# EAGLE design MinSys (EAGLE 7.2.0)
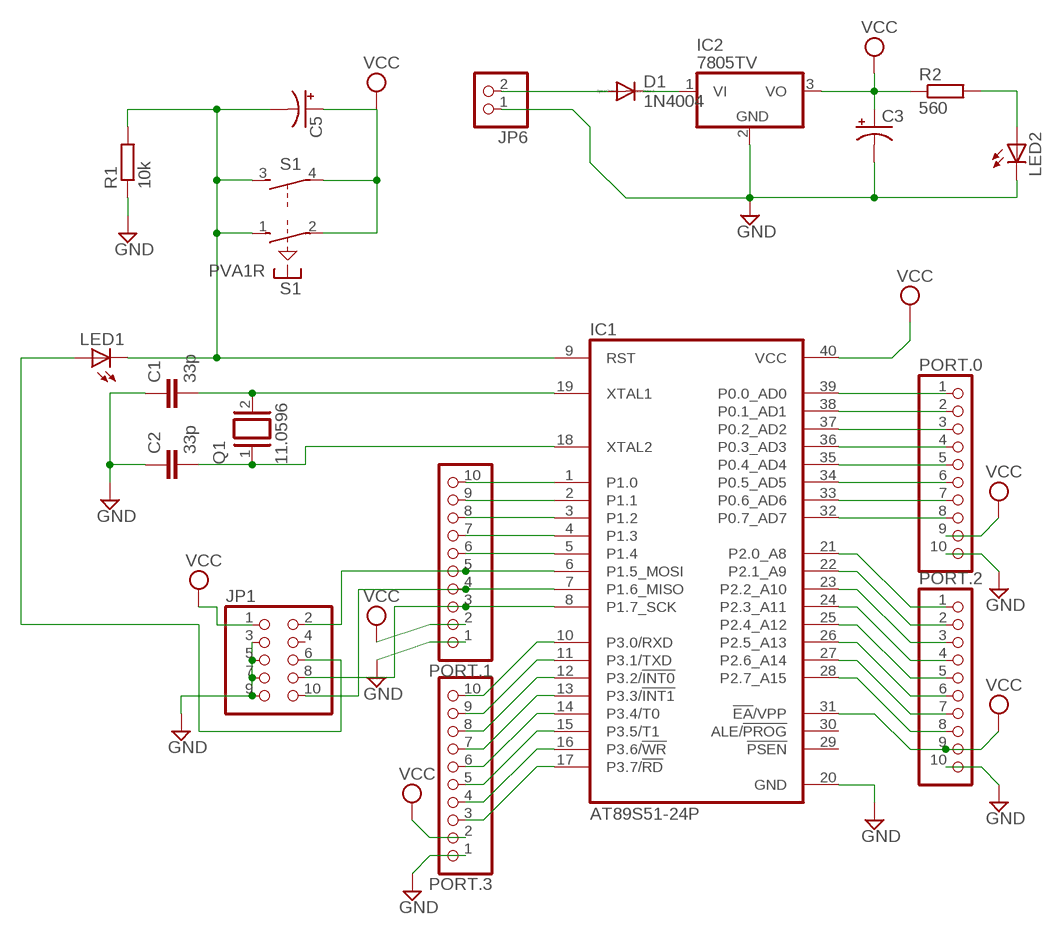
[diagram p0: schematic, sheet 1]

## Parts
C1  33p  C2,5-3  [C2.5-3]
C2  33p  C2,5-3  [C2.5-3]
C3  CPOL-USE3.5-8  [E3,5-8]
C5  CPOL-USE2.5-6  [E2,5-6]
D1  1N4004  [DO41-10]
IC1  AT89S51-24P  [DIL40]
IC2  7805TV  [TO220V]
JP1  PINHD-2X5  [2X05]
JP6  PINHD-1X2  [1X02]
LED1  LED3MM  [LED3MM]
LED2  LED3MM  [LED3MM]
PORT.0  PINHD-1X10  [1X10]
PORT.1  PINHD-1X10  [1X10]
PORT.2  PINHD-1X10  [1X10]
PORT.3  PINHD-1X10  [1X10]
Q1  11.0596  XTAL/S  [QS]
R1  10k  R-EU_0207/10  [0207/10]
R2  560  R-EU_0207/10  [0207/10]
S1  PVA1R  [PVA1R]

## Nets
GND: C1.1 C2.1 C3.- IC1.20(GND) IC2.2(GND) JP1.3 JP1.5 JP1.7 JP1.9 JP6.1 LED2.K(C) PORT.0.10 PORT.1.1 PORT.2.10 PORT.3.1 R1.1
N$1: IC1.10(P3.0/RXD) PORT.3.10
N$2: IC1.11(P3.1/TXD) PORT.3.9
N$3: IC1.12(P3.2/!INT0) PORT.3.8
N$4: IC1.13(P3.3/!INT1) PORT.3.7
N$5: IC1.14(P3.4/T0) PORT.3.6
N$6: IC1.15(P3.5/T1) PORT.3.5
N$7: IC1.16(P3.6/!WR) PORT.3.4
N$8: IC1.17(P3.7/!RD) PORT.3.3
N$9: C1.2 IC1.19(XTAL1) Q1.2
N$10: C2.2 IC1.18(XTAL2) Q1.1
N$11: IC1.21(P2.0_A8) PORT.2.1
N$12: IC1.22(P2.1_A9) PORT.2.2
N$13: IC1.23(P2.2_A10) PORT.2.3
N$14: IC1.24(P2.3_A11) PORT.2.4
N$15: IC1.25(P2.4_A12) PORT.2.5
N$16: IC1.26(P2.5_A13) PORT.2.6
N$17: IC1.27(P2.6_A14) PORT.2.7
N$18: IC1.28(P2.7_A15) PORT.2.8
N$19: IC1.1(P1.0) PORT.1.10
N$20: IC1.2(P1.1) PORT.1.9
N$21: IC1.3(P1.2) PORT.1.8
N$22: IC1.4(P1.3) PORT.1.7
N$23: IC1.5(P1.4) PORT.1.6
N$24: D1.A JP6.2
N$25: IC1.7(P1.6_MISO) JP1.10 PORT.1.4
N$26: IC1.8(P1.7_SCK) JP1.8 PORT.1.3
N$27: IC1.39(P0.0_AD0) PORT.0.1
N$28: IC1.38(P0.1_AD1) PORT.0.2
N$29: IC1.37(P0.2_AD2) PORT.0.3
N$30: IC1.36(P0.3_AD3) PORT.0.4
N$31: IC1.35(P0.4_AD4) PORT.0.5
N$32: IC1.34(P0.5_AD5) PORT.0.6
N$33: IC1.33(P0.6_AD6) PORT.0.7
N$34: IC1.32(P0.7_AD7) PORT.0.8
N$35: JP1.6 LED1.A
N$36: D1.C IC2.1(VI)
N$38: C5.- IC1.9(RST) LED1.K(C) R1.2 S1.1(1:S) S1.3(2:S)
N$39: IC1.6(P1.5_MOSI) JP1.2 PORT.1.5
N$41: LED2.A R2.2
VCC: C3.+ C5.+ IC1.31(!EA!/VPP) IC1.40(VCC) IC2.3(VO) JP1.1 PORT.0.9 PORT.1.2 PORT.2.9 PORT.3.2 R2.1 S1.2(1:P) S1.4(2:P)
Unconnected: IC1.29(!PSEN) IC1.30(ALE/!PROG) JP1.4

## Library data of the parts
C1 C2 = capacitor-wima:C: CAPACITOR naming: grid - package width
C3 C5 = rcl:CPOL-US: POLARIZED CAPACITOR, American symbol
D1 = diode:1N4004: DIODE general purpose rectifier, 1 A
IC1 = atmel:AT89S51-*: 8-bit Microcontroller with 4K BytesIn-System Programmable Flash Source: http://www.atmel.com/dyn/resources/prod_documents/doc2487.pdf; MPN: AT89S51-24PU; OC_FARNELL: 1095739; OC_NEWARK: 96K6578
IC2 = linear:78*: Positive VOLTAGE REGULATOR Source: http://cache.national.com/ds/LM/LM78L05.pdf http://www.fairchildsemi.com/ds/LM/LM7805.pdf
JP1 = pinhead:PINHD-2X5: PIN HEADER
JP6 = pinhead:PINHD-1X2: PIN HEADER
LED1 LED2 = led:LED: LED OSRAM: - CHIPLED LG R971, LG N971, LY N971, LG Q971, LY Q971, LO R971, LY R971 LH N974, LH R974 LS Q976, LO Q976, LY Q976 LO Q996 - Hyper CHIPLED LW Q18S LB Q993, LB Q99A, LB R99A - SideLED LS A670, LO A670, LY A670, LG A670, LP A670 LB A673, LV A673, LT A673, LW A673 LH A674 LY A675 LS A676, LA A676, LO A676, LY A676, LW A676 LS A679, LY A679, LG A679 - Hyper Micro SIDELED® LS Y876, LA Y876, LO Y876, LY Y876 LT Y87S - SmartLED LW L88C, LW L88S LB L89C, LB L89S, LG L890 LS L89K, LO L89K, LY L89K LS L896, LA L896, LO L896, LY L896 - TOPLED LS T670, LO T670, LY T670, LG T670, LP T670 LSG T670, LSP T670, LSY T670, LOP T670, LYG T670 LG T671, LOG T671, LSG T671 LB T673, LV T673, LT T673, LW T673 LH T674 LS T676, LA T676, LO T676, LY T676, LB T676, LH T676, LSB T676, LW T676 LB T67C, LV T67C, LT T67C, LS T67K, LO T67K, LY T67K, LW E67C LS E67B, LA E67B, LO E67B, LY E67B, LB E67C, LV E67C, LT E67C LW T67C LS T679, LY T679, LG T679 LS T770, LO T770, LY T770, LG T770, LP T770 LB T773, LV T773, LT T773, LW T773 LH T774 LS E675, LA E675, LY E675, LS T675 LS T776, LA T776, LO T776, LY T776, LB T776 LHGB T686 LT T68C, LB T68C - Hyper Mini TOPLED® LB M676 - Mini TOPLED Santana® LG M470 LS M47K, LO M47K, LY M47K Source: http://www.osram.convergy.de LUXEON: - LUMILED® LXK2-PW12-R00, LXK2-PW12-S00, LXK2-PW14-U00, LXK2-PW14-V00 LXK2-PM12-R00, LXK2-PM12-S00, LXK2-PM14-U00 LXK2-PE12-Q00, LXK2-PE12-R00, LXK2-PE12-S00, LXK2-PE14-T00, LXK2-PE14-U00 LXK2-PB12-K00, LXK2-PB12-L00, LXK2-PB12-M00, LXK2-PB14-N00, LXK2-PB14-P00, LXK2-PB14-Q00 LXK2-PR12-L00, LXK2-PR12-M00, LXK2-PR14-Q00, LXK2-PR14-R00 LXK2-PD12-Q00, LXK2-PD12-R00, LXK2-PD12-S00 LXK2-PH12-R00, LXK2-PH12-S00 LXK2-PL12-P00, LXK2-PL12-Q00, LXK2-PL12-R00 Source: www.luxeon.com KINGBRIGHT: KA-3528ASYC Source: www.kingbright.com
PORT.0 PORT.1-PORT.3 = pinhead:PINHD-1X10: PIN HEADER
Q1 = special:XTAL/S: CRYSTAL
R1 = rcl:R-EU_: RESISTOR, European symbol
R2 = resistor:R-EU_: RESISTOR, European symbol
S1 = switch-misc:PVA1R: ITT SWITCH

## Board
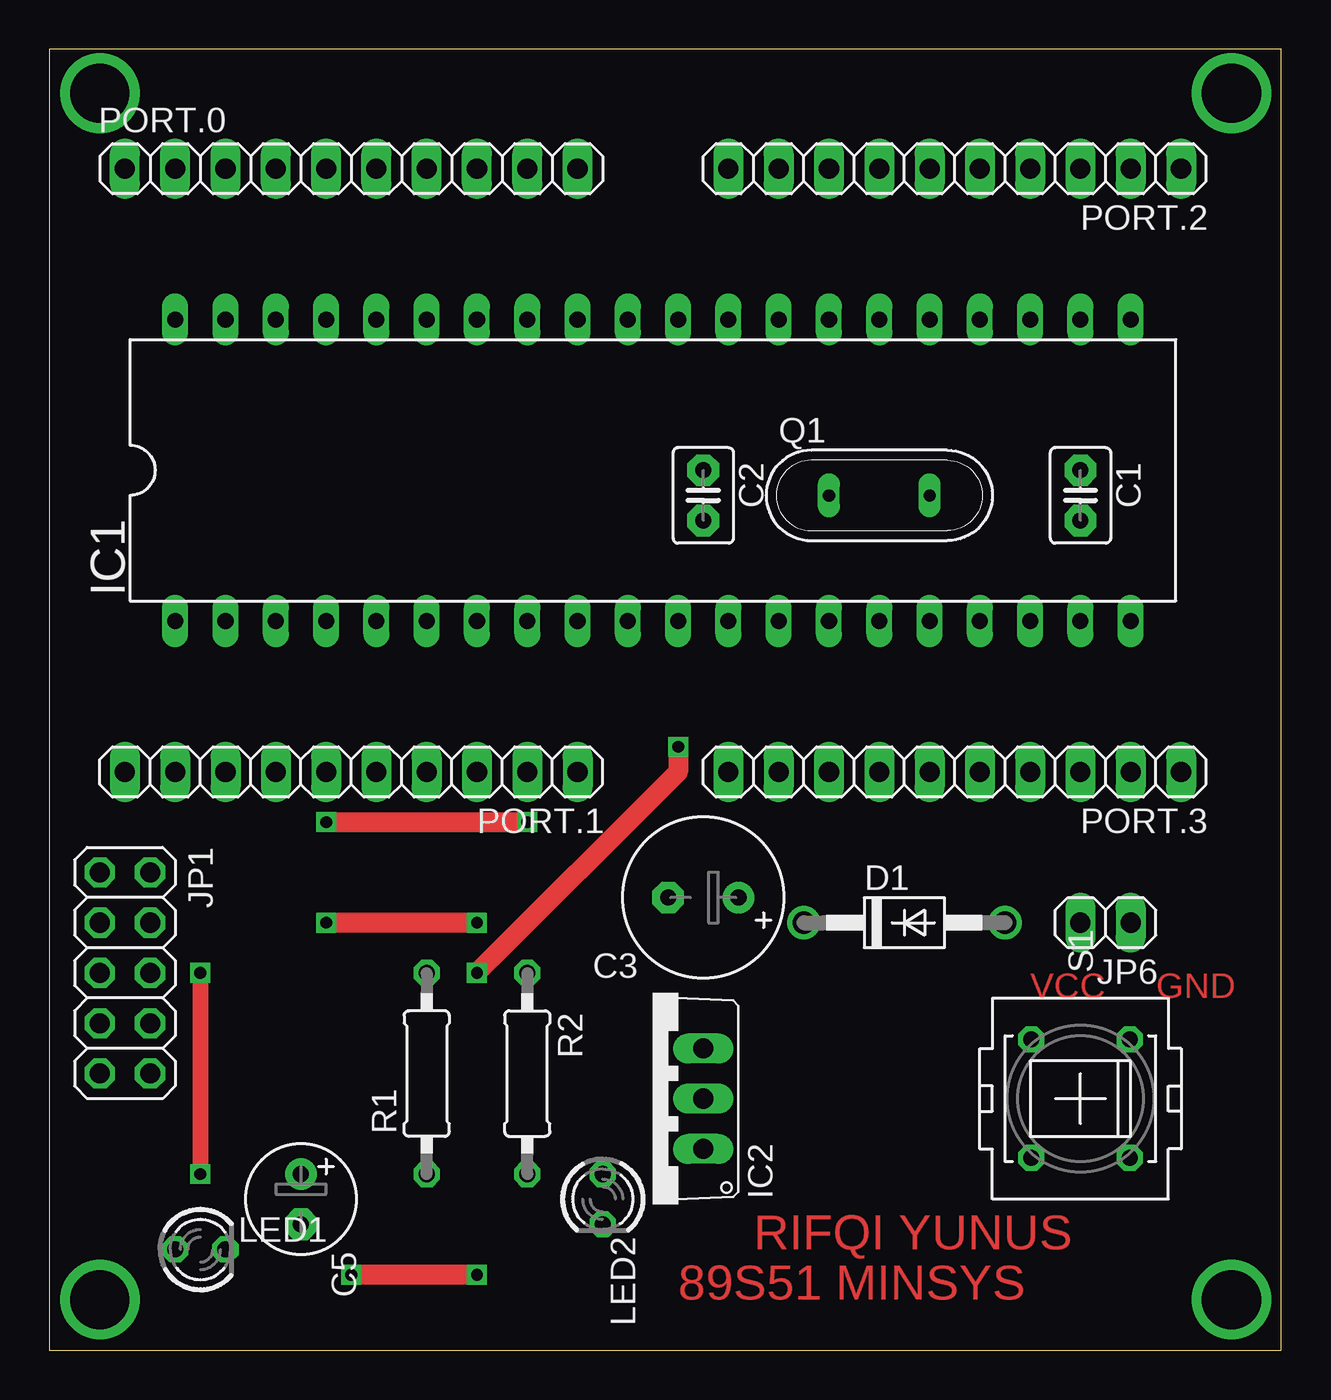
[diagram p1: board, top side]
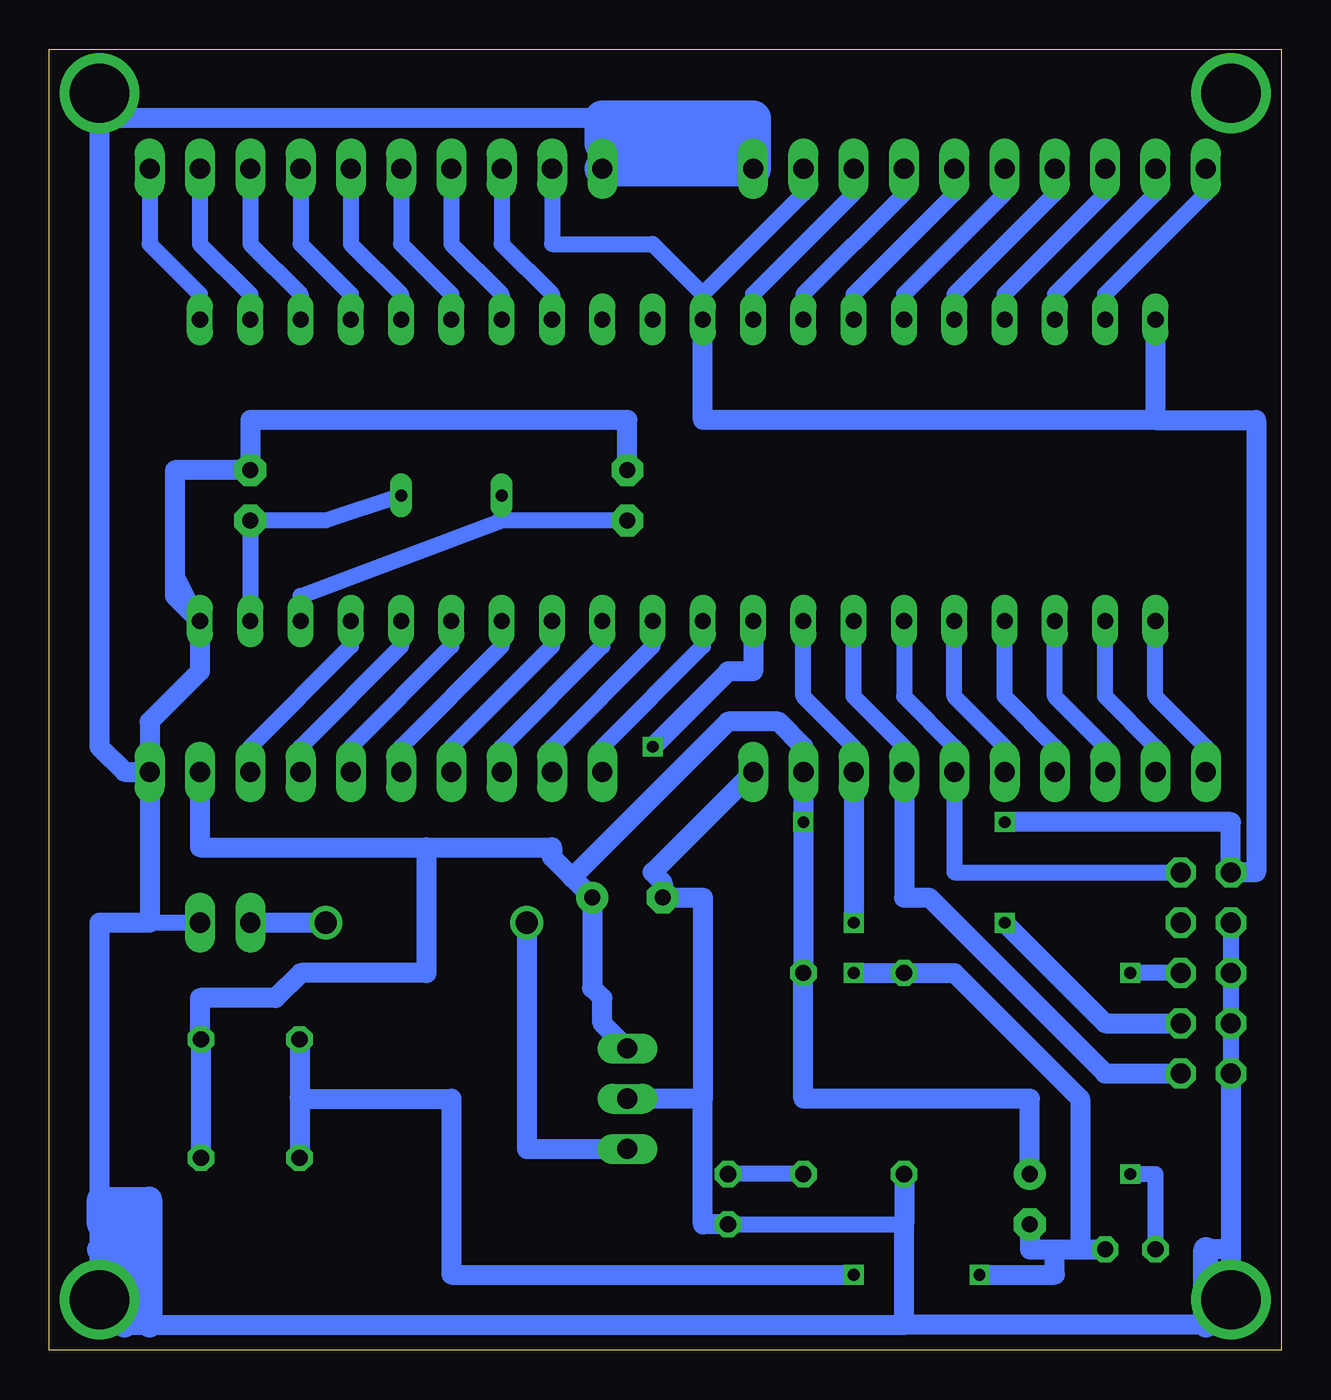
[diagram p2: board, bottom side, seen from below]

Size 62.21 x 65.71 mm. Coordinates in mm from the lower left corner, seen from the top.
Outline: 0,0 62.21,0 62.21,65.71 0,65.71 0,0
Copper layers (1*16): Top 0.035mm / dielectric 1.5mm / Bottom 0.035mm
Design rules "default": minimum track width 10mil, minimum drill 24mil, track to track 8mil, track to pad 8mil, pad to pad 8mil, via to via 8mil, smd to smd 8mil, copper to edge 40mil, drill to drill 8mil, minimum pad ring 10mil, minimum via ring 8mil, stop-mask expansion 4mil, vias tented up to drill 0mil, thermal gap 10mil

### Footprints (pad centres in the part's own frame; a part is rotated, then mirrored left to right if it is on the bottom)
C2.5-3 = drill 0.813 pad 1.6 octagon: 1 -1.27,0; 2 1.27,0
E3,5-8 = drill 0.813 pad 1.6: + -1.778,0 | drill 0.813 pad 1.6 octagon: - 1.778,0
E2,5-6 = drill 0.813 pad 1.6: + -1.27,0 | drill 0.813 pad 1.6 octagon: - 1.27,0
DO41-10 = drill 1.118: A 5.08,0; C -5.08,0
DIL40 = drill 0.813 long: 1 -24.13,-7.62; 2 -21.59,-7.62; 3 -19.05,-7.62; 4 -16.51,-7.62; 5 -13.97,-7.62; 6 -11.43,-7.62; 7 -8.89,-7.62; 8 -6.35,-7.62; 9 -3.81,-7.62; 10 -1.27,-7.62; 11 1.27,-7.62; 12 3.81,-7.62; 13 6.35,-7.62; 14 8.89,-7.62; 15 11.43,-7.62; 16 13.97,-7.62; 17 16.51,-7.62; 18 19.05,-7.62; 19 21.59,-7.62; 20 24.13,-7.62; 21 24.13,7.62; 22 21.59,7.62; 23 19.05,7.62; 24 16.51,7.62; 25 13.97,7.62; 26 11.43,7.62; 27 8.89,7.62; 28 6.35,7.62; 29 3.81,7.62; 30 1.27,7.62; 31 -1.27,7.62; 32 -3.81,7.62; 33 -6.35,7.62; 34 -8.89,7.62; 35 -11.43,7.62; 36 -13.97,7.62; 37 -16.51,7.62; 38 -19.05,7.62; 39 -21.59,7.62; 40 -24.13,7.62
TO220V = drill 1.016 long: 1 -2.54,-2.54; 2 0,-2.54; 3 2.54,-2.54
2X05 = drill 1.016 octagon: 1 -5.08,-1.27; 2 -5.08,1.27; 3 -2.54,-1.27; 4 -2.54,1.27; 5 0,-1.27; 6 0,1.27; 7 2.54,-1.27; 8 2.54,1.27; 9 5.08,-1.27; 10 5.08,1.27
1X02 = drill 1.016 long: 1 -1.27,0; 2 1.27,0
LED3MM = drill 0.813 octagon: A -1.27,0; K 1.27,0
1X10 = drill 1.016 long: 1 -11.43,0; 2 -8.89,0; 3 -6.35,0; 4 -3.81,0; 5 -1.27,0; 6 1.27,0; 7 3.81,0; 8 6.35,0; 9 8.89,0; 10 11.43,0
QS = drill 0.61 long: 1 -2.54,0; 2 2.54,0
0207/10 = drill 0.813 octagon: 1 -5.08,0; 2 5.08,0
PVA1R = drill 0.813 octagon: 1 -2.997,2.489; 2 -2.997,-2.489; 3 2.997,2.489; 4 2.997,-2.489

### Placement (x,y rotation side)
C1  52.07,43.18 270 top
C2  33.02,43.18 270 top
C3  33.02,22.86 180 top
C5  12.7,7.62 270 top
D1  43.18,21.59 0 top
IC1  30.48,44.45 0 top
IC2  30.48,12.7 90 top
JP1  3.81,19.05 270 top
JP6  53.34,21.59 180 top
LED1  7.62,5.08 0 top
LED2  27.94,7.62 270 top
PORT.0  15.24,59.69 0 top
PORT.1  15.24,29.21 180 top
PORT.2  45.72,59.69 180 top
PORT.3  45.72,29.21 180 top
Q1  41.91,43.18 0 top
R1  19.05,13.97 90 top
R2  24.13,13.97 270 top
S1  52.07,12.7 90 top

### Tracks (layer width: path | path; a pad name or v marks a point on that pad's centre or on a via)
GND  (via drill 3)
  Bottom 0.8: JP6.1 57.15,21.59 | IC1.20 55.88,39.37 55.88,44.45
  Bottom 0.813: LED2.K 19.05,6.35 | JP1.3 JP1.5 JP1.7 JP1.9
  Bottom 1.016: R1.1 19.05,6.35 19.05,1.27 | PORT.1.1 31.75,24.13 31.24,23.62 C3.- 29.21,22.86 29.21,12.7 | JP1.9 2.54,5.08 | 19.05,1.27 3.81,1.27 2.54,1.27 v2.54,2.54 2.54,5.08 | LED2.K 29.21,6.35 29.21,12.7 | 29.21,12.7 IC2.2 | PORT.2.10 34.29,62.23 59.69,62.23 59.69,30.48 58.42,29.21 PORT.3.1 | C2.1 33.02,46.99 52.07,46.99 C1.1 55.88,44.45 55.88,38.1 IC1.20 54.61,34.29 57.15,31.75 PORT.3.1 | PORT.3.1 57.15,21.59 59.69,21.59 59.69,7.62 | 19.05,1.27 57.15,1.27 58.42,1.27 59.69,1.27 v59.69,2.54 59.69,5.08 59.69,6.35 | 2.54,5.08 3.81,5.08
  Bottom 1.27: 3.81,1.27 3.81,5.08 | 59.69,5.08 58.42,5.08 | 58.42,5.08 58.42,1.27 | 58.42,5.08 58.42,6.35 59.69,6.35 59.69,7.62 57.15,7.62 57.15,1.27
  Bottom 1.8: PORT.2.10 PORT.0.10 | PORT.0.10 26.67,60.96 34.29,60.96 34.29,62.23 26.67,62.23 PORT.0.10
N$1
  Bottom 0.8: IC1.10 29.21,35.56 34.29,30.48 PORT.3.10
N$2
  Bottom 0.8: IC1.11 31.75,35.56 36.83,30.48 PORT.3.9
N$3
  Bottom 0.8: IC1.12 34.29,35.56 39.37,30.48 PORT.3.8
N$4
  Bottom 0.8: IC1.13 36.83,35.56 41.91,30.48 PORT.3.7
N$5
  Bottom 0.8: IC1.14 39.37,35.56 44.45,30.48 PORT.3.6
N$6
  Bottom 0.8: IC1.15 41.91,35.56 46.99,30.48 PORT.3.5
N$7
  Bottom 0.8: IC1.16 44.45,35.56 49.53,30.48 PORT.3.4
N$8
  Bottom 0.8: IC1.17 46.99,35.56 52.07,30.48 PORT.3.3
N$9
  Bottom 0.8: Q1.2 48.26,41.91 C1.2 IC1.19
N$10
  Bottom 0.8: C2.2 39.37,41.91 | 39.37,41.91 Q1.1 | IC1.18 49.53,38.1 39.37,41.91
N$11
  Bottom 0.8: PORT.2.1 57.15,55.88 54.61,53.34 IC1.21
N$12
  Bottom 0.8: PORT.2.2 54.61,55.88 52.07,53.34 IC1.22
N$13
  Bottom 0.8: PORT.2.3 52.07,55.88 49.53,53.34 IC1.23
N$14
  Bottom 0.8: PORT.2.4 49.53,55.88 46.99,53.34 IC1.24
N$15
  Bottom 0.8: PORT.2.5 46.99,55.88 44.45,53.34 IC1.25
N$16
  Bottom 0.8: PORT.2.6 44.45,55.88 41.91,53.34 IC1.26
N$17
  Bottom 0.8: PORT.2.7 41.91,55.88 39.37,53.34 IC1.27
N$18
  Bottom 0.8: PORT.2.8 39.37,55.88 36.83,53.34 IC1.28
N$19
  Bottom 0.8: PORT.1.10 3.81,30.48 6.35,33.02 IC1.1
N$20
  Bottom 0.8: PORT.1.9 6.35,30.48 8.89,33.02 IC1.2
N$21
  Bottom 0.8: PORT.1.8 8.89,30.48 11.43,33.02 IC1.3
N$22
  Bottom 0.8: PORT.1.7 11.43,30.48 13.97,33.02 IC1.4
N$23
  Bottom 0.8: PORT.1.6 13.97,30.48 16.51,33.02 IC1.5
N$24
  Bottom 1.016: D1.A JP6.2
N$25
  Bottom 0.8: PORT.1.4 19.05,30.48 21.59,33.02 IC1.7
  Bottom 1.016: PORT.1.4 19.05,22.86 17.78,22.86 8.89,13.97 JP1.10
N$26  (via drill 0.6)
  Top 1.016: v21.59,21.59 v13.97,21.59
  Bottom 0.8: PORT.1.3 21.59,30.48 24.13,33.02 IC1.8
  Bottom 1.016: PORT.1.3 v21.59,21.59 | v13.97,21.59 8.89,16.51 JP1.8
N$27
  Bottom 0.8: PORT.0.1 3.81,58.42 8.89,53.34 IC1.39
N$28
  Bottom 0.8: PORT.0.2 6.35,58.42 11.43,53.34 IC1.38
N$29
  Bottom 0.8: PORT.0.3 8.89,58.42 13.97,53.34 IC1.37
N$30
  Bottom 0.8: PORT.0.4 11.43,58.42 16.51,53.34 IC1.36
N$31
  Bottom 0.8: PORT.0.5 13.97,58.42 19.05,53.34 IC1.35
N$32
  Bottom 0.8: PORT.0.6 16.51,58.42 21.59,53.34 IC1.34
N$33
  Bottom 0.8: PORT.0.7 19.05,58.42 24.13,53.34 IC1.33
N$34
  Bottom 0.8: PORT.0.8 21.59,58.42 26.67,53.34 IC1.32
N$35  (via drill 0.6)
  Top 0.813: v7.62,19.05 v7.62,8.89
  Bottom 0.813: JP1.6 v7.62,19.05 | v7.62,8.89 6.35,8.89 LED1.A
N$36
  Bottom 1.016: D1.C 38.1,10.16 IC2.1
N$37  (via drill 3)
  other vias: 2.54,63.5
N$38  (via drill 0.6)
  Top 1.016: v21.59,3.81 v15.24,3.81 | v31.75,30.48 31.75,29.21 v21.59,19.05
  Bottom 1.016: C5.- 12.7,5.08 11.43,5.08 | 11.43,5.08 10.16,5.08 | 10.16,5.08 LED1.K | 10.16,5.08 10.16,12.7 16.51,19.05 R1.2 v21.59,19.05 | S1.1 S1.3 49.58,12.75 49.53,12.7 41.91,12.7 41.91,3.81 v21.59,3.81 | v15.24,3.81 11.43,3.81 11.43,5.08 | IC1.9 26.67,34.29 27.94,34.29 v31.75,30.48
N$39
  Bottom 0.813: IC1.6 19.05,33.02 16.51,30.48 PORT.1.5 16.51,24.13 JP1.2
N$40  (via drill 3)
  other vias: 59.69,63.5
N$41
  Bottom 0.813: R2.2 LED2.A
VCC  (via drill 0.6)
  Top 1.016: v13.97,26.67 v24.13,26.67
  Bottom 0.8: PORT.0.9 24.13,58.42 29.21,53.34 | 29.21,53.34 IC1.31 | PORT.2.9 36.83,55.88 31.75,55.88 29.21,53.34
  Bottom 1.016: IC2.3 34.29,16.51 34.29,17.78 34.8,18.29 C3.+ 35.81,23.88 | C5.+ 12.7,12.7 24.13,12.7 R2.1 v24.13,26.67 PORT.1.2 24.13,30.48 25.4,31.75 27.94,31.75 35.81,23.88 | v13.97,26.67 2.54,26.67 JP1.1 1.27,24.13 1.27,46.99 6.35,46.99 | S1.2 S1.4 54.61,15.75 54.61,17.78 50.8,17.78 49.53,19.05 43.18,19.05 43.18,25.4 | PORT.3.2 54.61,25.4 43.18,25.4 | 43.18,25.4 36.83,25.4 36.83,24.89 35.81,23.88 | IC1.40 6.35,46.99 | 6.35,46.99 29.21,46.99 IC1.31
(copper drawn outside any net)
  shapes: Bottom area x1

### Text on the board
Top: VCC | GND | RIFQI YUNUS | 89S51 MINSYS